# Altium schematic sheet EMI_Prot_Circ.SchDoc
size A4
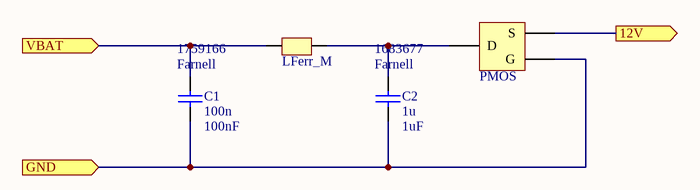
[diagram p0: EMI_Prot_Circ.SchDoc]

## Parts
C1  100n  value 100nF  Supplier 1: Farnell  Supplier Part Number 1: 1759166  [CAP_0805]
C2  1u  value 1uF  Supplier 1: Farnell  Supplier Part Number 1: 1683677  [CAP_0805]
LFerr_M  (no value)  [LFERRITE_MURATA_BLM21A]
PMOS  (no value)  [PMOS]

## Ports
12V (out), GND (in), VBAT (in)

## Nets
12V: PMOS.S ; port 12V
GND: C1.2 C2.2 PMOS.G ; port GND
VBAT: C1.1 LFerr_M.1 ; port VBAT
NetC2_1: C2.1 LFerr_M.2 PMOS.D

## Library data of the parts
C1 C2 = Cap Semi: Capacitor; Published: 8-Jun-2000; LatestRevisionDate: 29-May-2009; LatestRevisionNote: IPC-7351 Footprint Added.; PackageReference: C1206; Publisher: Altium Limited; PackageDescription: Chip Capacitor
LFerr_M = LFerrite_Murata: Murata ferrite chip bead - BLE32PN300SN1L; Impedance: 30ohm; MAX DC CUR: 10A; HelpURL: http://www.mouser.com/ds/2/281/c31e-522703.pdf; Supplier Part Number 1: 81-BLE32PN300SN1L; Supplier 1: Mouser
PMOS = PMOS: P channel Mosfet; HelpURL: http://www.mouser.com/ds/2/115/DMP6180SK3-247239.pdf; Supplier 1: Mouser; Supplier Part Number 1: 621-DMP6180SK3-13